# EAGLE design dps YZ (EAGLE 6.3)
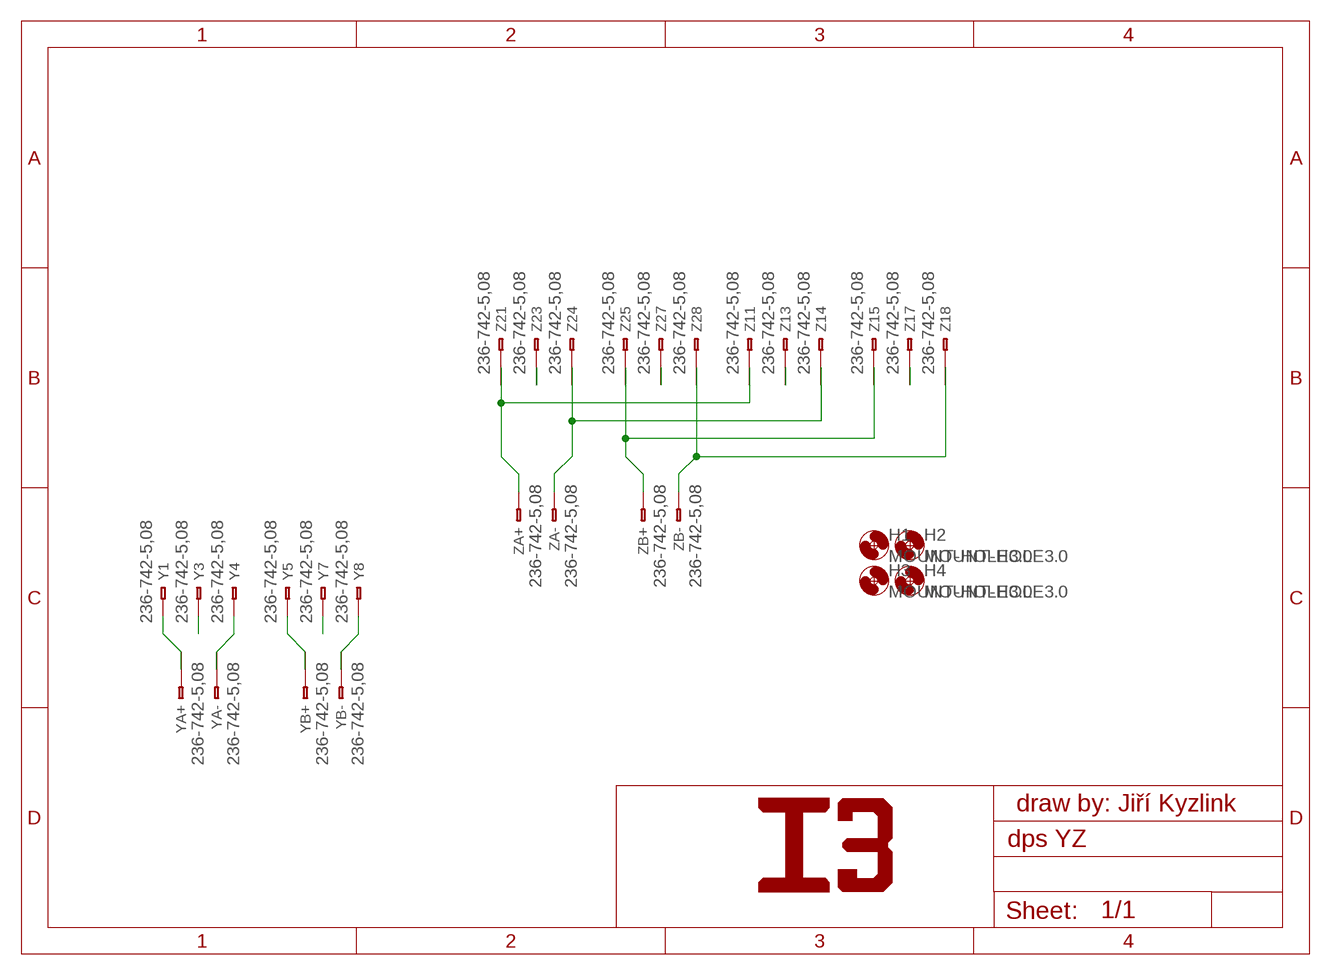
[diagram p0: schematic, sheet 1]

## Parts
H1  MOUNT-HOLE3.0  [3,0]
H2  MOUNT-HOLE3.0  [3,0]
H3  MOUNT-HOLE3.0  [3,0]
H4  MOUNT-HOLE3.0  [3,0]
Y1  236-742-5,08  [236-4XX]
Y3  236-742-5,08  [236-4XX]
Y4  236-742-5,08  [236-4XX]
Y5  236-742-5,08  [236-4XX]
Y7  236-742-5,08  [236-4XX]
Y8  236-742-5,08  [236-4XX]
YA+  236-742-5,08  [236-4XX]
YA-  236-742-5,08  [236-4XX]
YB+  236-742-5,08  [236-4XX]
YB-  236-742-5,08  [236-4XX]
Z11  236-742-5,08  [236-4XX]
Z13  236-742-5,08  [236-4XX]
Z14  236-742-5,08  [236-4XX]
Z15  236-742-5,08  [236-4XX]
Z17  236-742-5,08  [236-4XX]
Z18  236-742-5,08  [236-4XX]
Z21  236-742-5,08  [236-4XX]
Z23  236-742-5,08  [236-4XX]
Z24  236-742-5,08  [236-4XX]
Z25  236-742-5,08  [236-4XX]
Z27  236-742-5,08  [236-4XX]
Z28  236-742-5,08  [236-4XX]
ZA+  236-742-5,08  [236-4XX]
ZA-  236-742-5,08  [236-4XX]
ZB+  236-742-5,08  [236-4XX]
ZB-  236-742-5,08  [236-4XX]

## Nets
N$1: Z23.1@1(A1) Z23.1@2(B1)
N$2: Y3.1@1(A1) Y3.1@2(B1)
N$3: Y7.1@1(A1) Y7.1@2(B1)
N$4: Y8.1@1(A1) Y8.1@2(B1) YB-.1@1(A1) YB-.1@2(B1)
N$5: Z27.1@1(A1) Z27.1@2(B1)
N$6: Z17.1@1(A1) Z17.1@2(B1)
N$7: Y5.1@1(A1) Y5.1@2(B1) YB+.1@1(A1) YB+.1@2(B1)
N$8: Z13.1@1(A1) Z13.1@2(B1)
N$9: Z11.1@1(A1) Z11.1@2(B1) Z21.1@1(A1) Z21.1@2(B1) ZA+.1@1(A1) ZA+.1@2(B1)
N$10: Z14.1@1(A1) Z14.1@2(B1) Z24.1@1(A1) Z24.1@2(B1) ZA-.1@1(A1) ZA-.1@2(B1)
N$11: Z15.1@1(A1) Z15.1@2(B1) Z25.1@1(A1) Z25.1@2(B1) ZB+.1@1(A1) ZB+.1@2(B1)
N$14: Z18.1@1(A1) Z18.1@2(B1) Z28.1@1(A1) Z28.1@2(B1) ZB-.1@1(A1) ZB-.1@2(B1)
N$15: Y4.1@1(A1) Y4.1@2(B1) YA-.1@1(A1) YA-.1@2(B1)
N$16: Y1.1@1(A1) Y1.1@2(B1) YA+.1@1(A1) YA+.1@2(B1)

## Notes on the sheet
- draw by: Jiří Kyzlink

## Library data of the parts
H1-H4 = holes:MOUNT-HOLE: MOUNTING HOLE with drill center marker
Y1 Y3-Y5 Y7 Y8 YA+ YA- YB+ YB- Z11 Z13-Z15 Z17 Z18 Z21 Z23-Z25 Z27 Z28 ZA+ ZA- ZB+ ZB- = con-wago:236: Anreihbare Einzelklemme 2,5 mm² 16A Rastermaß 5/5,08 | 7,5/7,62 | 10/10,16

## Board
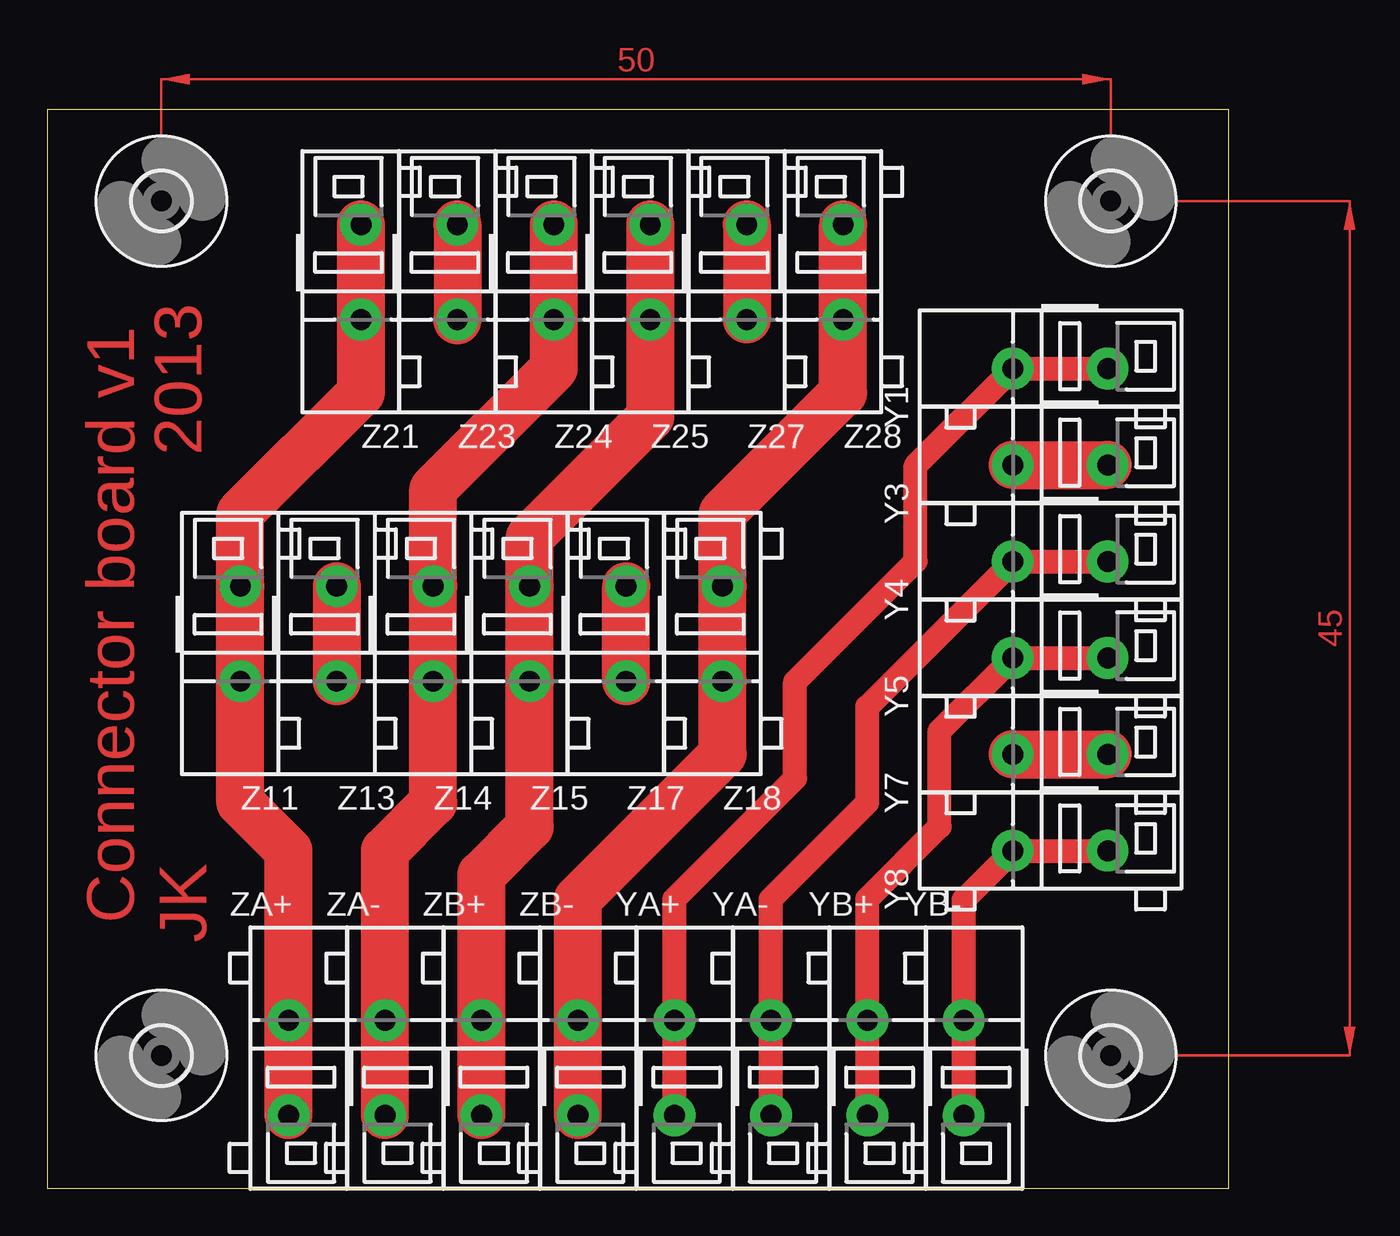
[diagram p1: board, top side]

Size 62.21 x 56.82 mm. Coordinates in mm from the lower left corner, seen from the top.
Outline: 0,0 62.21,0 62.21,56.82 0,56.82 0,0
Copper layers (1*16): Top 0.035mm / dielectric 1.5mm / Bottom 0.035mm
Design rules "default": minimum track width 10mil, minimum drill 24mil, track to track 8mil, track to pad 8mil, pad to pad 8mil, via to via 8mil, smd to smd 8mil, copper to edge 40mil, drill to drill 8mil, minimum pad ring 10mil, minimum via ring 8mil, stop-mask expansion 4mil, vias tented up to drill 0mil, thermal gap 10mil

### Footprints (pad centres in the part's own frame; a part is rotated, then mirrored left to right if it is on the bottom)
3,0 = hole 3: 0,0
236-4XX = drill 1.1 pad 2.2: 1@1 0,-2.5; 1@2 0,2.5

### Placement (x,y rotation side)
H1  56,7 0 top
H2  56,52 0 top
H3  6,52 0 top
H4  6,7 0 top
Y1  53.34,43.18 90 top
Y3  53.34,38.1 90 top
Y4  53.34,33.02 90 top
Y5  53.34,27.94 90 top
Y7  53.34,22.86 90 top
Y8  53.34,17.78 90 top
YA+  33.02,6.35 0 top
YA-  38.1,6.35 0 top
YB+  43.18,6.35 0 top
YB-  48.26,6.35 0 top
Z11  10.16,29.21 180 top
Z13  15.24,29.21 180 top
Z14  20.32,29.21 180 top
Z15  25.4,29.21 180 top
Z17  30.48,29.21 180 top
Z18  35.56,29.21 180 top
Z21  16.51,48.26 180 top
Z23  21.59,48.26 180 top
Z24  26.67,48.26 180 top
Z25  31.75,48.26 180 top
Z27  36.83,48.26 180 top
Z28  41.91,48.26 180 top
ZA+  12.7,6.35 0 top
ZA-  17.78,6.35 0 top
ZB+  22.86,6.35 0 top
ZB-  27.94,6.35 0 top

### Tracks (layer width: path | path; a pad name or v marks a point on that pad's centre or on a via)
N$1
  Top 2.54: Z23.1@1 Z23.1@2 21.59,45.72
N$2
  Top 2.54: Y3.1@2 Y3.1@1
N$3
  Top 2.54: Y7.1@2 Y7.1@1
N$4
  Top 1.27: YB-.1@1 YB-.1@2 48.26,15.2 Y8.1@2 Y8.1@1
N$5
  Top 2.54: Z27.1@1 Z27.1@2
N$6
  Top 2.54: Z17.1@2 Z17.1@1
N$7
  Top 1.27: YB+.1@1 YB+.1@2 43.18,15.24 46.99,19.05 46.99,24.09 Y5.1@2 Y5.1@1 55.88,27.94
N$8
  Top 2.54: Z13.1@1 Z13.1@2
N$9
  Top 2.54: ZA+.1@1 ZA+.1@2 12.7,17.78 10.16,20.32 Z11.1@2 Z11.1@1 10.16,35.56 16.51,41.91 Z21.1@2 Z21.1@1
N$10
  Top 2.54: ZA-.1@1 ZA-.1@2 17.78,17.78 20.32,20.32 Z14.1@2 Z14.1@1 20.32,36.83 26.67,43.18 Z24.1@2 Z24.1@1
N$11
  Top 2.54: ZB+.1@1 ZB+.1@2 22.86,16.51 25.4,19.05 Z15.1@2 Z15.1@1 25.4,34.29 31.75,40.64 Z25.1@2 Z25.1@1
N$14
  Top 2.54: ZB-.1@1 ZB-.1@2 27.94,15.24 35.56,22.86 Z18.1@2 Z18.1@1 35.56,35.56 41.91,41.91 Z28.1@2 Z28.1@1
N$15
  Top 1.27: YA-.1@1 YA-.1@2 38.1,15.24 43.18,20.32 43.18,25.36 Y4.1@2 Y4.1@1
N$16
  Top 1.27: YA+.1@1 YA+.1@2 | 33.02,8.89 YA+.1@2 | YA+.1@2 33.02,15.24 39.37,21.59 39.37,26.67 45.72,33.02 45.72,38.06 Y1.1@2 Y1.1@1
(copper drawn outside any net)
  shapes: Top area x2

### Text on the board
Top: 2013 | Connector board v1 | JK